# EAGLE schematic Blimp PCB v27 (EAGLE 9.7.0)
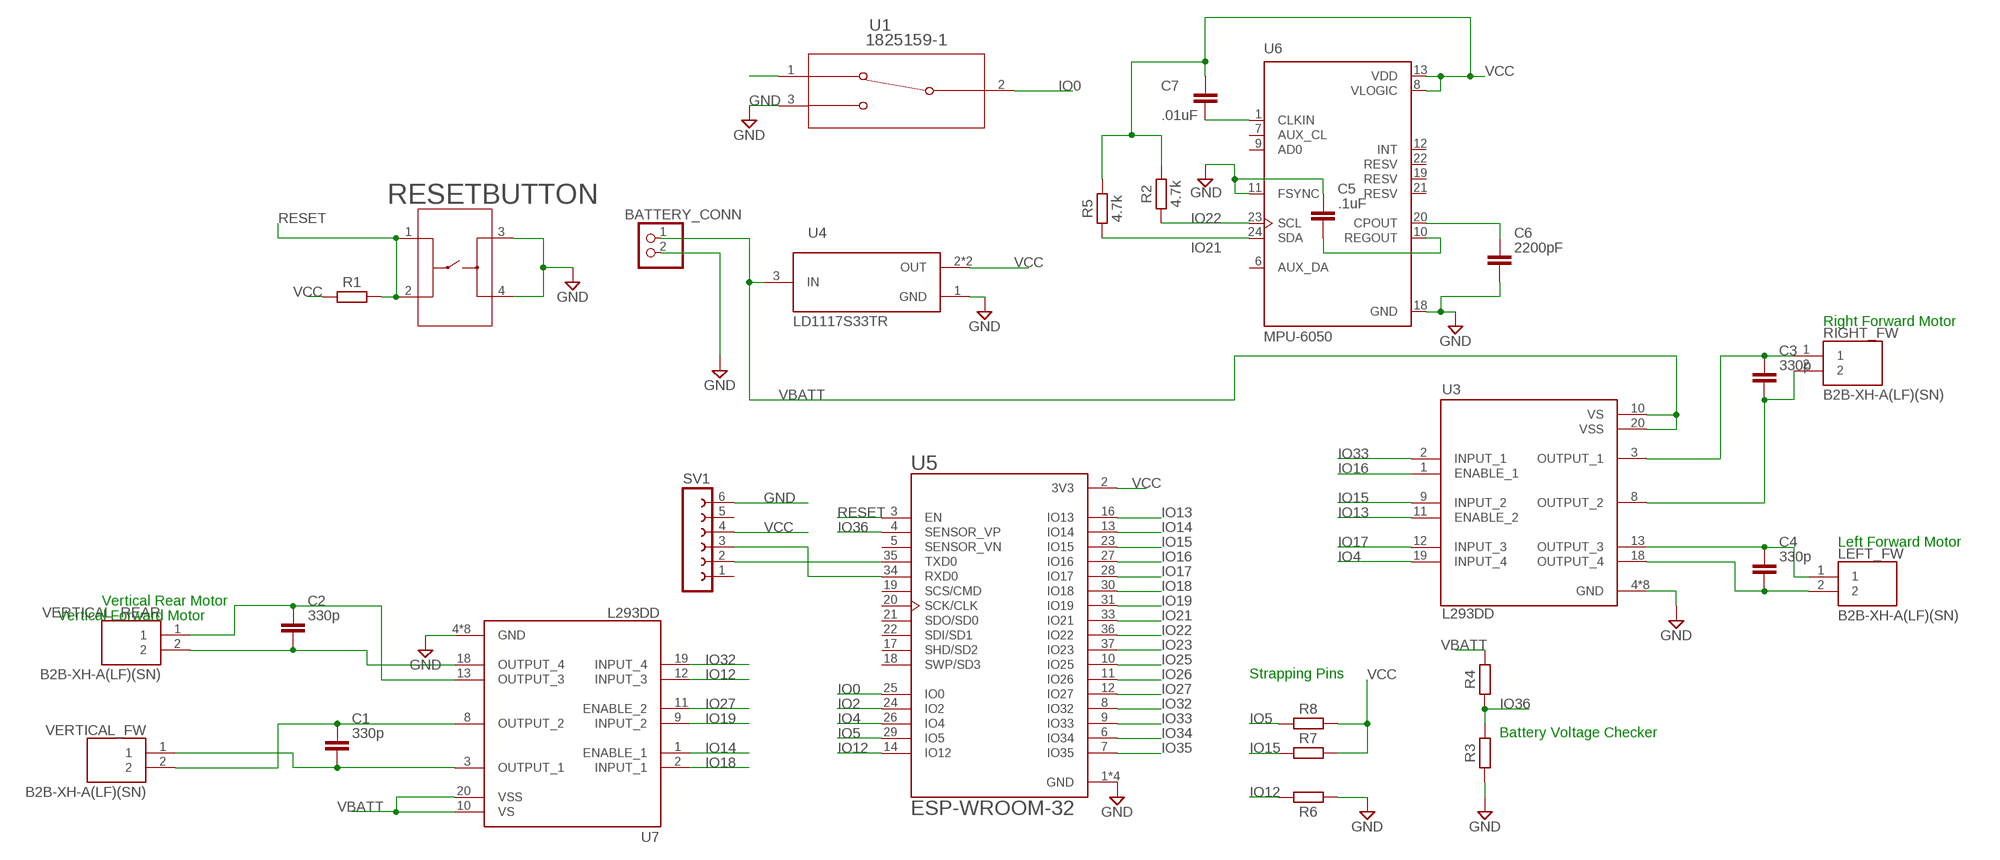
[diagram p0: schematic, sheet 1]

## Parts
BATTERY_CONN  PINHD-1X2  [1X02]
C1  330p  C_CHIP-0402(1005-METRIC)  [CAPC1005X60]
C2  330p  C_CHIP-0402(1005-METRIC)  [CAPC1005X60]
C3  330p  C_CHIP-0402(1005-METRIC)  [CAPC1005X60]
C4  330p  C_CHIP-0402(1005-METRIC)  [CAPC1005X60]
C5  .1uF  C_CHIP-0805(2012-METRIC)  [CAPC2012X110]
C6  2200pF  C_CHIP-0805(2012-METRIC)  [CAPC2012X110]
C7  .01uF  C_CHIP-0805(2012-METRIC)  [CAPC2012X110]
LEFT_FW  B2B-XH-A(LF)(SN)  [JST_B2B-XH-A(LF)(SN)]
R1  R_CHIP-1206(3216-METRIC)  [RESC3216X70]
R2  4.7k  R_CHIP-1206(3216-METRIC)  [RESC3216X70]
R3  R_CHIP-0603(1608-METRIC)  [RESC1608X60]
R4  R_CHIP-0603(1608-METRIC)  [RESC1608X60]
R5  4.7k  R_CHIP-1206(3216-METRIC)  [RESC3216X70]
R6  R_CHIP-1206(3216-METRIC)  [RESC3216X70]
R7  R_CHIP-1206(3216-METRIC)  [RESC3216X70]
R8  R_CHIP-1206(3216-METRIC)  [RESC3216X70]
RESETBUTTON  1-1825910-0  [SWITCH_1-1825910-0]
RIGHT_FW  B2B-XH-A(LF)(SN)  [JST_B2B-XH-A(LF)(SN)]
SV1  FE06-1  [FE06]
U1  1825159-1  [SW3-SLIDE-2POL_P98]
U3  L293DD  [SOIC127P1032X265-20N]
U4  LD1117S33TR  [SOT230P700X180-4N]
U5  ESP-WROOM-32  [MODULE_ESP-WROOM-32]
U6  MPU-6050  [QFN50P400X400X95-24N]
U7  L293DD  [SOIC127P1032X265-20N]
VERTICAL_FW  B2B-XH-A(LF)(SN)  [JST_B2B-XH-A(LF)(SN)]
VERTICAL_REAR  B2B-XH-A(LF)(SN)  [JST_B2B-XH-A(LF)(SN)]

## Nets
GND: BATTERY_CONN.2 C5.1 C6.2 R3.1 R6.1 RESETBUTTON.3 RESETBUTTON.4 SV1.6 U1.3 U3.4(GND) U3.5(GND) U3.6(GND) U3.7(GND) U3.14(GND) U3.15(GND) U3.16(GND) U3.17(GND) U4.1(GND) U5.1(GND) U5.1.1(GND) U5.15(GND) U5.38(GND) U6.11(FSYNC) U6.18(GND) U7.4(GND) U7.5(GND) U7.6(GND) U7.7(GND) U7.14(GND) U7.15(GND) U7.16(GND) U7.17(GND)
IO0: U1.2 U5.25(IO0)
IO2: U5.24(IO2)
IO4: U3.19(INPUT_4) U5.26(IO4)
IO5: R8.1 U5.29(IO5)
IO12: R6.2 U5.14(IO12) U7.12(INPUT_3)
IO13: U3.11(ENABLE_2) U5.16(IO13)
IO14: U5.13(IO14) U7.1(ENABLE_1)
IO15: R7.1 U3.9(INPUT_2) U5.23(IO15)
IO16: U3.1(ENABLE_1) U5.27(IO16)
IO17: U3.12(INPUT_3) U5.28(IO17)
IO18: U5.30(IO18) U7.2(INPUT_1)
IO19: U5.31(IO19) U7.9(INPUT_2)
IO21: R5.1 U5.33(IO21) U6.24(SDA)
IO22: R2.1 U5.36(IO22) U6.23(SCL)
IO23: U5.37(IO23)
IO25: U5.10(IO25)
IO26: U5.11(IO26)
IO27: U5.12(IO27) U7.11(ENABLE_2)
IO32: U5.8(IO32) U7.19(INPUT_4)
IO33: U3.2(INPUT_1) U5.9(IO33)
IO34: U5.6(IO34)
IO35: U5.7(IO35)
IO36: R3.2 R4.1 U5.4(SENSOR_VP)
N$1: C3.1 RIGHT_FW.1 U3.3(OUTPUT_1)
N$2: C3.2 RIGHT_FW.2 U3.8(OUTPUT_2)
N$3: C4.1 LEFT_FW.1 U3.13(OUTPUT_3)
N$5: C1.1 U7.8(OUTPUT_2) VERTICAL_FW.2
N$6: C1.2 U7.3(OUTPUT_1) VERTICAL_FW.1
N$7: C2.1 U7.13(OUTPUT_3) VERTICAL_REAR.1
N$8: C2.2 U7.18(OUTPUT_4) VERTICAL_REAR.2
N$9: SV1.2 U5.35(TXD0)
N$10: C6.1 U6.20(CPOUT)
N$11: U1.1
N$12: C5.2 U6.10(REGOUT)
N$14: C7.2 U6.1(CLKIN)
N$15: C4.2 LEFT_FW.2 U3.18(OUTPUT_4)
N$22: SV1.3 U5.34(RXD0)
RESET: R1.2 RESETBUTTON.1 RESETBUTTON.2 U5.3(EN)
VBATT: BATTERY_CONN.1 R4.2 U3.10(VS) U3.20(VSS) U4.3(IN) U7.10(VS) U7.20(VSS)
VCC: C7.1 R1.1 R2.2 R5.2 R7.2 R8.2 SV1.4 U4.2(OUT) U4.4(OUT) U5.2(3V3) U6.8(VLOGIC) U6.13(VDD)
Unconnected: SV1.1 SV1.5 U5.5(SENSOR_VN) U5.17(SHD/SD2) U5.18(SWP/SD3) U5.19(SCS/CMD) U5.20(SCK/CLK) U5.21(SDO/SD0) U5.22(SDI/SD1) U6.6(AUX_DA) U6.7(AUX_CL) U6.9(AD0) U6.12(INT) U6.19(RESV) U6.21(RESV) U6.22(RESV)

## Notes on the sheet
- Right Forward Motor
- Left Forward Motor
- Vertical Rear Motor
- Vertical Forward Motor
- Strapping Pins
- Battery Voltage Checker

## Library data of the parts
BATTERY_CONN = Connector:PINHD-1X2: PIN HEADER; CATEGORY: CONNECTOR; SUB-CATEGORY: PIN-HEADER
C1-C7 = Capacitor:C: Capacitor - Generic; CATEGORY: Capacitor
LEFT_FW RIGHT_FW VERTICAL_FW VERTICAL_REAR = B2B-XH-A_LF__SN_:B2B-XH-A(LF)(SN): XH Series 2 Position 2.5 mm Pitch Through Hole Top Entry Shrouded Header; MANUFACTURER: JST; PARTREV: N/A; STANDARD: Manufacturer Recommendations
R1-R8 = Resistor:R: Resistor Fixed - Generic; CATEGORY: Resistor; SUB-CATEGORY: Fixed
RESETBUTTON = Switches:1-1825910-0; BUILT_BY: EMA_UL_Team; CATEGORY: Tactile Switches; COPYRIGHT: Copyright (C) 2016 Accelerated Designs. All rights reserved; DESCRIPTION: FSM6JH=6MM TACT SWITCH, HIGH TEMP; MANUFACTURER_PART_NUMBER: 1-1825910-0; PART_STATUS: active; SERIES: Unknown; VENDOR: TE Connectivity
SV1 = con-lsta:FE06-1: FEMALE HEADER; OC_FARNELL: unknown; OC_NEWARK: unknown
U1 = Switches:1825159-1; BUILT_BY: EMA_UL_Team; CATEGORY: Slide Switches; COPYRIGHT: Copyright (C) 2016 Accelerated Designs. All rights reserved; DESCRIPTION: STS121PC04=SPDT SLIDE SWITCH; MANUFACTURER_PART_NUMBER: 1825159-1; PART_STATUS: pending discontinuance; SERIES: Raychem STSS; VENDOR: TE Connectivity
U3 U7 = L293DD:L293DD: L293DD Series Push - Pull Quad Channel Driver with Diodes - SOIC-20; MANUFACTURER: STMicroelectronics; PARTREV: N/A; STANDARD: IPC-7351B
U4 = LD1117S33TR:LD1117S33TR: LDO Voltage Regulators 3.3V 0.8A Positive; MANUFACTURER: ST Microelectronics
U5 = ESP-WROOM-32:ESP-WROOM-32: Module: combo; GPIO, I2C x2, I2S x2, SDIO, SPI x3, UART x3; 19.5dBm; AVAILABILITY: Warning; DESCRIPTION: Module: combo; GPIO, I2C x2, I2S x2, SDIO, SPI x3, UART x3; 19.5dBm; MF: Olimex LTD; MP: ESP-WROOM-32; PACKAGE: Module Espressif Systems; PRICE: 4.57 USD
U6 = MPU-6050:MPU-6050: MPU-6050 Six-Axis (Gyro + Accelerometer) MEMS MotionTracking™ Devices; AVAILABILITY: Good; DESCRIPTION: IMU ACCEL/GYRO 3-AXIS I2C 24QFN; MF: TDK; MP: MPU-6050; PACKAGE: QFN-24 InvenSense; PARTREV: 3.4; PRICE: 5.45 USD; STANDARD: IPC-7351B